# EAGLE design RFM69 USB Gateway 0.7 (EAGLE 7.6.0)
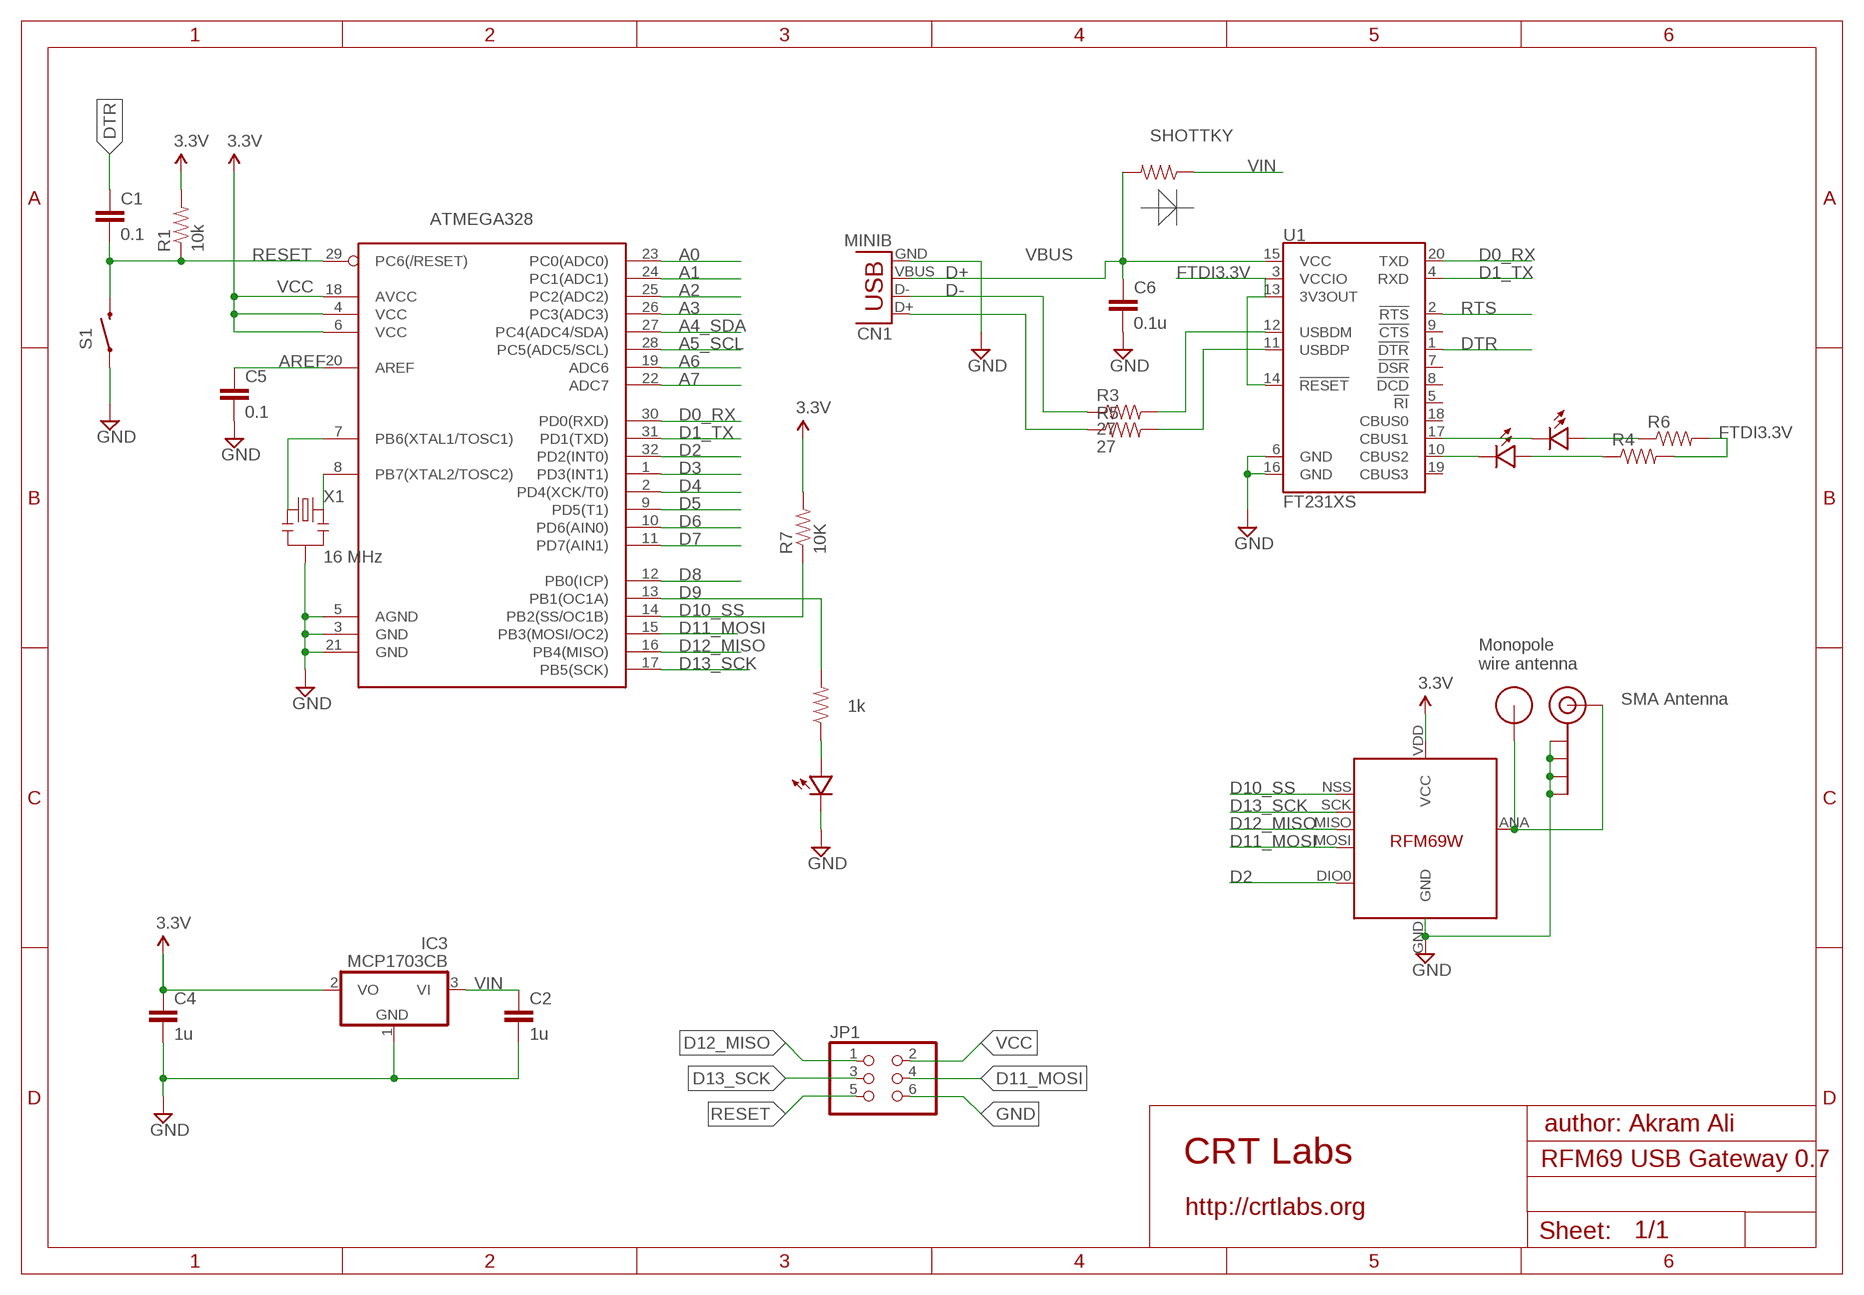
[diagram p0: schematic, sheet 1]

## Parts
ATMEGA328  ATMega-328  ATMEGA168/328TQFP32  [TQFP32-08]
C1  0.1  CAP0805  [0805]
C2  1u  CAP0805  [0805]
C4  1u  CAP0805  [0805]
C5  0.1  CAP0805  [0805]
C6  0.1u  CAP0805  [0805]
CN1  MINIB  USB-A-H  [USB-A-H]
D  SHOTTKY  RESISTOR0805  [0805]
IC3  MCP1703CB  [SOT23]
J$1  SMA_EDGE  [SMA-EDGE]
JP1  PINHD-2X3  [2X03]
R1  10k  RESISTOR0805  [0805]
R2  1k  RESISTOR0805-RES  [0805]
R3  27  RESISTOR0805-RES  [0805]
R4  RESISTOR0805-RES  [0805]
R5  27  RESISTOR0805-RES  [0805]
R6  RESISTOR0805-RES  [0805]
R7  10K  RESISTOR0805-RES  [0805]
S1  SWITCH-MOMENTARY-2SMD-ALT01  [TACTILE-SWITCH-SMD-ALT01]
U1  FT231XS  [SSOP20_L]
U$1  RFM12B_ANTENNA  [RFM12B-ANTENNA]
U$2  LED0805  [0805-LED]
U$4  LED0805  [0805-LED]
U$5  RFM69  [RFM69W-MINPADS]
U$7  LED0805  [0805-LED]
X1  16 MHz  RESONATORSMD  [RESONATOR-SMD]

## Nets
A0: ATMEGA328.23(PC0(ADC0))
A1: ATMEGA328.24(PC1(ADC1))
A2: ATMEGA328.25(PC2(ADC2))
A3: ATMEGA328.26(PC3(ADC3))
A4_SDA: ATMEGA328.27(PC4(ADC4/SDA))
A5_SCL: ATMEGA328.28(PC5(ADC5/SCL))
A6: ATMEGA328.19(ADC6)
A7: ATMEGA328.22(ADC7)
AREF: ATMEGA328.20(AREF) C5.1
D0_RX: ATMEGA328.30(PD0(RXD)) U1.20(TXD)
D1_TX: ATMEGA328.31(PD1(TXD)) U1.4(RXD)
D2: ATMEGA328.32(PD2(INT0)) U$5.DIO0
D3: ATMEGA328.1(PD3(INT1))
D4: ATMEGA328.2(PD4(XCK/T0))
D5: ATMEGA328.9(PD5(T1))
D6: ATMEGA328.10(PD6(AIN0))
D7: ATMEGA328.11(PD7(AIN1))
D8: ATMEGA328.12(PB0(ICP))
D9: ATMEGA328.13(PB1(OC1A)) R2.2
D10_SS: ATMEGA328.14(PB2(SS/OC1B)) R7.1 U$5.NSS(SEL)
D11_MOSI: ATMEGA328.15(PB3(MOSI/OC2)) JP1.4 U$5.MOSI
D12_MISO: ATMEGA328.16(PB4(MISO)) JP1.1 U$5.MISO
D13_SCK: ATMEGA328.17(PB5(SCK)) JP1.3 U$5.SCK
D+: CN1.D+ R5.1
D-: CN1.D- R3.1
DTR: C1.1 U1.1(!DTR)
FTDI3.3V: R4.2 R6.2 U1.3(VCCIO) U1.13(3V3OUT) U1.14(!RESET)
GND [power]: ATMEGA328.3(GND) ATMEGA328.5(AGND) ATMEGA328.21(GND) C2.2 C4.2 C5.2 C6.2 CN1.GND IC3.1(GND) J$1.GND@0(GND) J$1.GND@1(GND) J$1.GND@2(GND) J$1.GND@3(GND) JP1.6 S1.1 S1.2 U1.6(GND) U1.16(GND) U$2.MINUS U$5.GND X1.2
N$1: ATMEGA328.7(PB6(XTAL1/TOSC1)) X1.1
N$2: R2.1 U$2.PLUS
N$3: J$1.SIG(SIGNAL) U$1.P$1 U$5.ANA(ANT)
N$4: R3.2 U1.12(USBDM)
N$5: R5.2 U1.11(USBDP)
N$6: U1.17(CBUS1) U$4.MINUS
N$7: U1.10(CBUS2) U$7.MINUS
N$8: R4.1 U$7.PLUS
N$9: R6.1 U$4.PLUS
N$21: ATMEGA328.8(PB7(XTAL2/TOSC2)) X1.3
RESET: ATMEGA328.29(PC6(/RESET)) C1.2 JP1.5 R1.1 S1.3 S1.4
RTS: U1.2(!RTS)
VBUS [power]: C6.1 CN1.VBUS D.2 U1.15(VCC)
VCC: ATMEGA328.4(VCC) ATMEGA328.6(VCC) ATMEGA328.18(AVCC) C4.1 IC3.2(VO) JP1.2 R1.2 R7.2 U$5.VDD(VCC) ; supply symbol labelled 3.3V
VIN: C2.1 D.1 IC3.3(VI)
Unconnected: U1.5(!RI) U1.7(!DSR) U1.8(!DCD) U1.9(!CTS) U1.18(CBUS0) U1.19(CBUS3)

## Notes on the sheet
- Monopole
  wire antenna
- SMA Antenna
- author: Akram Ali
- CRT Labs
- http://crtlabs.org

## Library data of the parts
ATMEGA328 = LowPowerLab:ATMEGA168/328: Atmel 32-pin 8-bit micro, 16k flash.
C1 C2 C5 C6 = SparkFun:CAP: Capacitor Standard 0603 ceramic capacitor, and 0.1" leaded capacitor.
C4 = LowPowerLab:CAP: Capacitor Standard 0603 ceramic capacitor, and 0.1" leaded capacitor.
CN1 = SparkFun-Connectors:USB: USB Connectors USB-B-PTH is fully proven SKU : PRT-00139/CONN-08278 USB-miniB is fully proven SKU : PRT-00587 USB-A-PCB is untested. USB-A-H is throughly reviewed, but untested. Spark Fun Electronics SKU : PRT-00437 USB-B-SMT is throughly reviewed, but untested. Needs silkscreen touching up. USB-A-S has not been used/tested USB-MB-H has not been used/tested USB-MICROB has been used. CONN-09505; PROD_ID: CONN-08367
D R1 = LowPowerLab:RESISTOR: Resistor Basic schematic elements and footprints for 0603, 1206, and PTH resistors.
IC3 = linear:MCP1703: 250 mA, 16V, Low Quiescent Current LDO Regulator Source: http://ww1.microchip.com/downloads/en/DeviceDoc/22049b.pdf
J$1 = SparkFun-Connectors:SMA_EDGE: SMA Antenna Connector End launch SMA connector. The paste layer has been removed so that the connector can be hand soldered onto the board after reflow.
JP1 = pinhead:PINHD-2X3: PIN HEADER
R2-R7 = SparkFun:RESISTOR: Resistor Basic schematic elements and footprints for 0603, 1206, and PTH resistors.
S1 = Testing:SWITCH-MOMENTARY-2: Various NO switches- pushbuttons, reed, etc
U1 = SparkFun-DigitalIC:FT231X: FTDI FT231X Full Speed USB to Full-handshake UART This USB2.0 Full Speed IC offers a compact bridge to full handshake UART interfaces. The device is a UART, capable of operating up to 3MBaud, with low power consumption (8mA). The FT231X includes the complete FT-X series feature set and enables USB to be added into a system design quickly and easily over a UART interface.; PROD_ID: IC-11524
U$1 = LowPowerLab:RFM12B_ANTENNA
U$2 U$4 U$7 = LowPowerLab:LED
U$5 = LowPowerLab:RFM69
X1 = SparkFun:RESONATOR: Resonator Small SMD resonator. This is the itty bitty 10/20MHz resonators with built in caps. CSTCE10M0G55 and CSTCE20M0V53. Footprint has been reviewed closely but hasn't been tested yet.

## Net classes
1 power: width 0.381 mm, clearance 0.254 mm

## Board
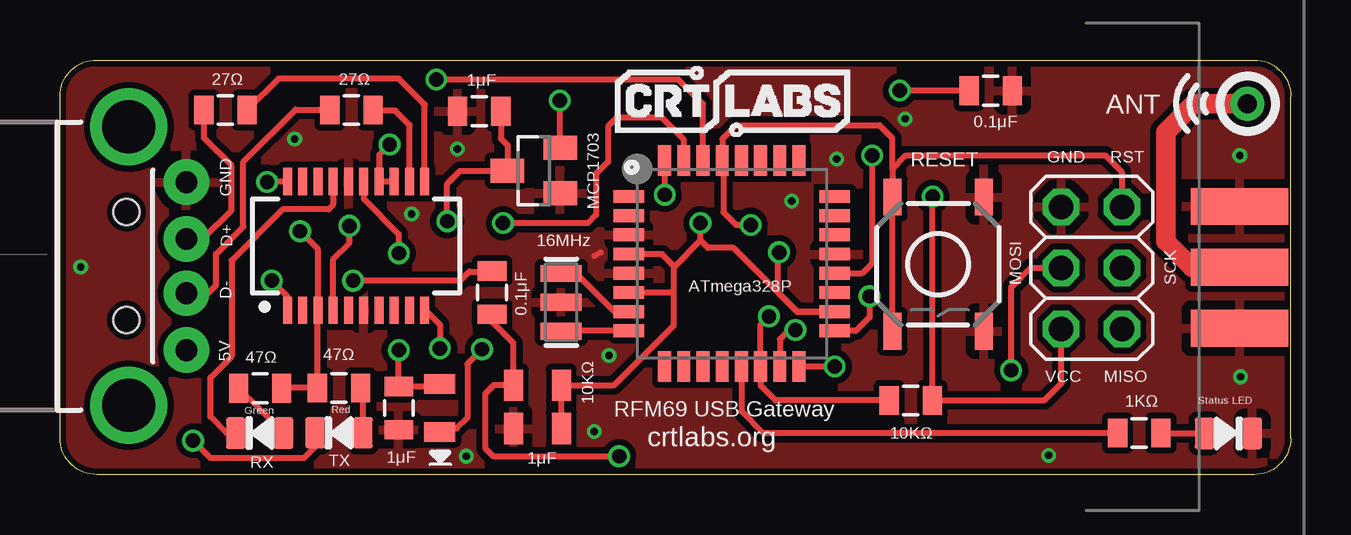
[diagram p1: board, top side]
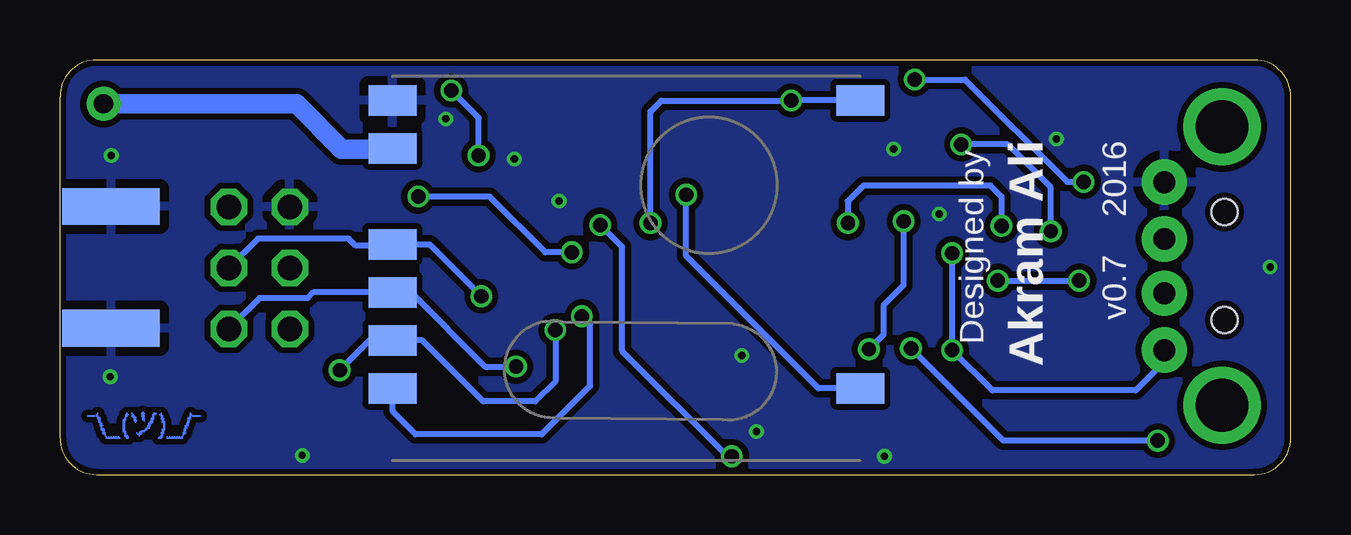
[diagram p2: board, bottom side, seen from below]

Size 51.31 x 17.27 mm. Coordinates in mm from the lower left corner, seen from the top.
Outline: 1.57,17.27 49.78,17.27 arc-90 51.31,15.75 51.31,1.52 arc-90 49.78,0 1.52,0 arc-90 0,1.52 0,15.75 arc-90 1.52,17.27 1.57,17.27
Copper layers (1*16): Top 0.035mm / dielectric 1.5mm / Bottom 0.035mm
Design rules "ITEADstudio_DRC *": minimum track width 6mil, minimum drill 12mil, track to track 6mil, track to pad 6mil, pad to pad 6mil, via to via 6mil, smd to smd 0mil, copper to edge 10mil, drill to drill 10mil, minimum pad ring 10mil, minimum via ring 6mil, stop-mask expansion 2mil, vias tented up to drill 100mil, thermal gap 15mil
tRestrict: area 6.6,12.3 to 7.5,12.9

### Footprints (pad centres in the part's own frame; a part is rotated, then mirrored left to right if it is on the bottom)
TQFP32-08 = smd 1.27 x 0.533: 1 -4.293,2.8; 2 -4.293,2; 3 -4.293,1.2; 4 -4.293,0.4; 5 -4.293,-0.4; 6 -4.293,-1.2; 7 -4.293,-2; 8 -4.293,-2.8; 17 4.293,-2.8; 18 4.293,-2; 19 4.293,-1.2; 20 4.293,-0.4; 21 4.293,0.4; 22 4.293,1.2; 23 4.293,2; 24 4.293,2.8 | smd 0.533 x 1.27: 9 -2.8,-4.293; 10 -2,-4.293; 11 -1.2,-4.293; 12 -0.4,-4.293; 13 0.4,-4.293; 14 1.2,-4.293; 15 2,-4.293; 16 2.8,-4.293; 25 2.8,4.293; 26 2,4.293; 27 1.2,4.293; 28 0.4,4.293; 29 -0.4,4.293; 30 -1.2,4.293; 31 -2,4.293; 32 -2.8,4.293
0805 = smd 0.8 x 1.2: 1 -0.9,0; 2 0.9,0
0805' = smd 0.8 x 1.3: 1 -1,0; 2 1,0
USB-A-H = drill 0.914 pad 1.88: D+ 2.4,1.127; D- 2.4,-1.127; GND 2.4,3.5; VBUS 2.4,-3.5 | drill 2.2: GND2 0,-5.8; GND3 0,5.8 | hole 1.1: -0.1,2.25; -0.1,-2.25
SOT23 = smd 1 x 1.4: 1 -0.95,-1.1; 2 0.95,-1.1; 3 0,1.1
SMA-EDGE = smd 1.524 x 4.064: GND@0 0,0; GND@1 5.08,0; SIG 2.54,0 | smd 1.524 x 4.064 bottom: GND@2 0,0; GND@3 5.08,0
2X03 = drill 1.016 octagon: 1 -2.54,-1.27; 2 -2.54,1.27; 3 0,-1.27; 4 0,1.27; 5 2.54,-1.27; 6 2.54,1.27
TACTILE-SWITCH-SMD-ALT01 = smd 1.524 x 0.762: 1 -2.794,1.905; 2 2.794,1.905; 3 -2.794,-1.905; 4 2.794,-1.905
SSOP20_L = smd 0.381 x 1.143: 1 -2.857,-2.68; 2 -2.223,-2.68; 3 -1.587,-2.68; 4 -0.953,-2.68; 5 -0.318,-2.68; 6 0.318,-2.68; 7 0.953,-2.68; 8 1.587,-2.68; 9 2.223,-2.68; 10 2.857,-2.68; 11 2.857,2.68; 12 2.223,2.68; 13 1.587,2.68; 14 0.953,2.68; 15 0.318,2.68; 16 -0.318,2.68; 17 -0.953,2.68; 18 -1.587,2.68; 19 -2.223,2.68; 20 -2.857,2.68
RFM12B-ANTENNA = drill 0.8 pad 1.422: P$1 0,0
0805-LED = smd 0.8 x 1.3: MINUS -1,0; PLUS 1,0
RFM69W-MINPADS = smd 2 x 1.27: ANA 8,-5; DIO0 -11.5,5; GND 8,-7; MISO 8,1; MOSI 8,3; NSS 8,5; SCK 8,-1; VDD -11.5,-7
RESONATOR-SMD = smd 0.7 x 1.7: 1 -1.2,0; 2 0,0; 3 1.2,0

### Placement (x,y rotation side)
ATMEGA328  28,8.79 0 top
C1  18.01,7.58 270 top
C2  17.48,15.14 180 top
C4  1u  [0805']  19.9,1.92 180 top
C5  38.8,15.99 0 top
C6  14.12,2.77 270 top
CN1  2.87,8.69 0 top
D  SHOTTKY  [0805']  15.82,2.77 90 top
IC3  19.75,12.66 90 top
J$1  49.17,6.1 90 top
JP1  43,8.61 90 top
R1  10k  [0805']  19.9,3.72 0 top
R2  44.98,1.73 180 top
R3  12.15,15.19 0 top
R4  11.63,3.61 180 top
R5  6.9,15.19 0 top
R6  8.34,3.59 0 top
R7  35.46,3.09 0 top
S1  36.6,8.76 270 top
U1  12.34,9.53 0 top
U$1  49.49,15.44 0 top
U$2  48.7,1.71 180 top
U$4  8.33,1.73 0 top
U$5  29.45,8.59 180 bottom
U$7  11.63,1.74 0 top
X1  20.89,7.18 270 top

### Tracks (layer width: path | path; a pad name or v marks a point on that pad's centre or on a via)
AREF  (via drill 0.6 pad 0.3)
  Top 0.254: C5.1 35.01,15.99 v35,16 | ATMEGA328.20 33.45,8.39 33.86,8.8 v33.86,13.3
  Bottom 0.254: v35,16 33.86,14.86 v33.86,13.3
D0_RX  (via drill 0.6 pad 0.3)
  Top 0.254: v15.68,16.46 25.78,16.46 26.8,15.44 ATMEGA328.30 | U1.20 v8.65,12.2 v8.64,12.19
  Bottom 0.254: v15.68,16.46 13.59,16.46 9.32,12.19 v8.64,12.19
D1_TX  (via drill 0.6 pad 0.3)
  Top 0.254: ATMEGA328.31 26,13.95 25.1,14.86 23.19,14.86 22.85,14.52 22.85,13.03 22.35,12.54 22.35,10.82 22.01,10.48 v18.47,10.48 | U1.4 11.39,8.97 12.06,9.64 v12.06,10.36
  Bottom 0.254: v12.06,10.36 12.06,11.58 12.52,12.04 17.82,12.04 18.47,11.39 v18.47,10.48
D2  (via drill 0.6 pad 0.3)
  Top 0.254: v25.21,11.66 ATMEGA328.32
  Bottom 0.254: 25.17,11.62 v25.21,11.66 25.21,9.11 19.69,3.59 U$5.DIO0
D9
  Top 0.254: ATMEGA328.13 28.4,2.64 29.31,1.73 R2.2
D10_SS  (via drill 0.6 pad 0.3)
  Top 0.254: ATMEGA328.14 | 29.31,4.39 ATMEGA328.14 | ATMEGA328.14 29.2,6.24 v29.55,6.59 | R7.1 29.82,3.09 29.21,3.7 ATMEGA328.14
  Bottom 0.254: U$5.NSS 37.44,2.63 36.49,1.68 31.23,1.68 29.21,3.7 29.21,6.25 v29.55,6.59
D11_MOSI  (via drill 0.6 pad 0.3)
  Top 0.254: v30.66,6.02 30.39,6.02 30.01,5.64 ATMEGA328.15 | v39.65,4.34 39.65,7.81 40.45,8.61 JP1.4
  Bottom 0.254: 30.62,5.98 v30.66,6.02 30.66,3.89 31.5,3.05 33.67,3.05 36.22,5.6 37.44,5.6 U$5.MOSI 37.47,5.6 38.39,5.6 v39.65,4.34
D12_MISO  (via drill 0.6 pad 0.3)
  Top 0.254: v32.3,4.5 ATMEGA328.16
  Bottom 0.254: v32.3,4.5 33.59,4.5 36.68,7.59 U$5.MISO 40.75,7.59 40.98,7.35 42.99,7.35 JP1.1
D13_SCK  (via drill 0.6 pad 0.3)
  Top 0.254: 32.33,6.02 ATMEGA328.17 33.17,5.98 33.74,6.55 v33.74,7.43
  Bottom 0.254: JP1.3 43.05,9.83 39.27,9.83 39,9.56 37.47,9.56 U$5.SCK 35.9,9.59 v33.74,7.43
D+
  Top 0.254: CN1.D+ 5.95,9.81 7.15,11.01 7.15,12.88 6.01,14.02 R5.1
D-
  Top 0.254: CN1.D- 6.18,7.56 6.5,7.89 6.5,9.18 7.65,10.33 7.65,13.03 9.82,15.2 11.24,15.2 R3.1
DTR  (via drill 0.6 pad 0.3)
  Top 0.254: U1.1 9.49,7.42 v8.83,8.08 | C1.1 17.98,8.46 17.06,8.46 16.67,8.08 v12.22,8.08
  Bottom 0.254: v12.22,8.08 v8.83,8.08
FTDI3.3V  (via drill 0.6 pad 0.3)
  Top 0.254: 10.78,6.82 U1.3 | U1.13 U1.14 13.32,12.23 13.32,13.34 v13.74,13.75 | R6.2 9.21,3.61 R4.2 10.73,6.82 U1.3 | U1.3 10.76,9.39 v10.01,10.13
  Bottom 0.254: v10.01,10.13 10.01,11.96 11.8,13.75 v13.74,13.75
GND  (via drill 0.3 pad 0.25)
  Top 0.254: 22.54,9.26 22.28,9.11
  other vias: 16.56,13.56 9.78,13.98 22.89,4.95 35.23,14.82 49.21,4.08 41.21,0.8 30.51,11.39 32.37,13.14 0.86,8.65 49.17,13.3 22.28,1.79 16.94,0.76 14.66,10.86
  pour Bottom: -1.04,21.11 -1.04,-3.66 52.25,-3.54 52.25,21.22
  pour Top: -0.36,21.07 -0.36,-3.7 52.1,-3.62 52.1,21.15
N$1
  Top 0.254: ATMEGA328.7 23.11,6.79 21.51,8.38 X1.1
N$2
  Top 0.254: R2.1 47.69,1.73 U$2.PLUS
N$3
  Top 0.813: J$1.SIG 47.17,8.64 46.09,9.72 46.09,14.26 47.27,15.44 U$1.P$1
  Bottom 0.813: U$5.ANA 37.47,13.56 39.57,13.56 41.45,15.44 U$1.P$1
N$4
  Top 0.254: U1.12 14.58,12.22 14.58,14.55 13.97,15.16 13.08,15.16 R3.2
N$5
  Top 0.254: U1.11 15.2,15.42 14.12,16.5 9.1,16.5 R5.2
N$6
  Top 0.254: U1.17 11.38,12.19 11.38,11.24 11.19,11.05 9.28,11.05 7.15,8.92 7.15,4.92 6.27,4.04 6.27,2.4 6.95,1.73 U$4.MINUS
N$7  (via drill 0.6 pad 0.3)
  Top 0.254: U$7.MINUS 10.78,1.31 10.16,0.69 6.27,0.69 v5.55,1.41 | 15.19,6.83 U1.10 15.24,6.85 15.84,6.25 v15.84,5.26
  Bottom 0.254: v5.55,1.41 11.99,1.41 v15.84,5.26
N$8
  Top 0.254: U$7.PLUS 12.63,3.51 R4.1
N$9
  Top 0.254: U$4.PLUS 9.18,1.91 R6.1
N$21
  Top 0.254: 20.71,5.99 X1.3 20.9,5.99 ATMEGA328.8
RESET  (via drill 0.6 pad 0.3)
  Top 0.254: v23.3,0.76 18.05,0.76 17.74,1.07 17.74,3.39 18.08,3.73 18.89,3.73 R1.1 18.9,5.47 18.01,6.36 C1.2 | S1.4 S1.3 34.7,12.73 | 34.7,12.73 35.27,13.3 43.57,13.3 44.26,12.61 JP1.5 | 34.7,12.73 34.7,14.02 34.16,14.55 28.18,14.55 27.61,13.98 ATMEGA328.29 27.65,13.04 27.65,10.93 28.18,10.4 v28.79,10.4
  Bottom 0.254: v23.3,0.76 23.49,0.76 27.88,5.14 27.88,9.49 v28.79,10.4
VBUS  (via drill 0.6 pad 0.3)
  Top 0.254: U1.15 12.66,11.48 14.12,10.02 v14.12,9.22 | D.2 15.77,3.67 C6.1 v14.12,5.18
  Top 0.305: C6.1 14.12,3.62
  Bottom 0.254: CN1.VBUS 5.27,4.7 6.46,3.51 12.45,3.51 v14.12,5.18 v14.12,9.22
VCC  (via drill 0.6 pad 0.3)
  Top 0.254: v29.97,9.26 29.93,9.22 29.93,7.58 30.73,6.79 ATMEGA328.18 30.73,6.78 28.07,9.45 27,9.45 26.7,9.75 | 26.7,9.75 v26.7,10.48 | C4.1 R1.2 23.1,3.72 25.59,6.21 25.59,7.54 | 25.59,7.54 25.59,8.69 | 25.59,8.69 25.1,9.18 ATMEGA328.4 | ATMEGA328.6 25.55,7.59 25.59,7.54 | 25.59,8.69 25.63,8.69 26.7,9.75 | v20.83,15.58 20.83,13.63 IC3.2 | JP1.2 41.74,6.06 41.74,3.81 41.02,3.09 R7.2 36.36,11.57 v36.37,11.58
  Bottom 0.254: v26.7,10.48 26.7,15.13 26.24,15.58 v20.83,15.58 v20.83,15.59 U$5.VDD | v29.97,9.26 31.08,9.26 33.4,11.58 v36.37,11.58
VIN  (via drill 0.6 pad 0.3)
  Top 0.254: D.1 16.54,1.92 16.98,2.36 16.98,4.61 v17.59,5.22 | v16.14,10.55 16.14,12.12 16.67,12.65 18.64,12.65 IC3.3 18.66,13.72 18.38,14 C2.1
  Bottom 0.254: v16.14,10.55 16.14,7.89 16.98,7.05 16.98,5.83 v17.59,5.22
(copper drawn outside any net)
  shapes: Bottom area x133

### Text on the board
tPlace: ANT | RFM69 USB Gateway | crtlabs.org
bPlace: v0.7 2016 | Akram Ali | Designed by
tDocu: All dimensions in mils | Moteino-USB
_tsilk: 27Ω | 27Ω | 1μF | 0.1μF | RESET | GND | RST | GND | MCP1703 | 16MHz | D+ | SCK | ATmega328P | MOSI | D- | 0.1μF | 5V | 47Ω | 47Ω | VCC | MISO | 10KΩ | 1KΩ | Status LED | Green | Red | 1μF | 1μF | 10KΩ | RX | TX